# Altium project WEB_Server.PrjPcb
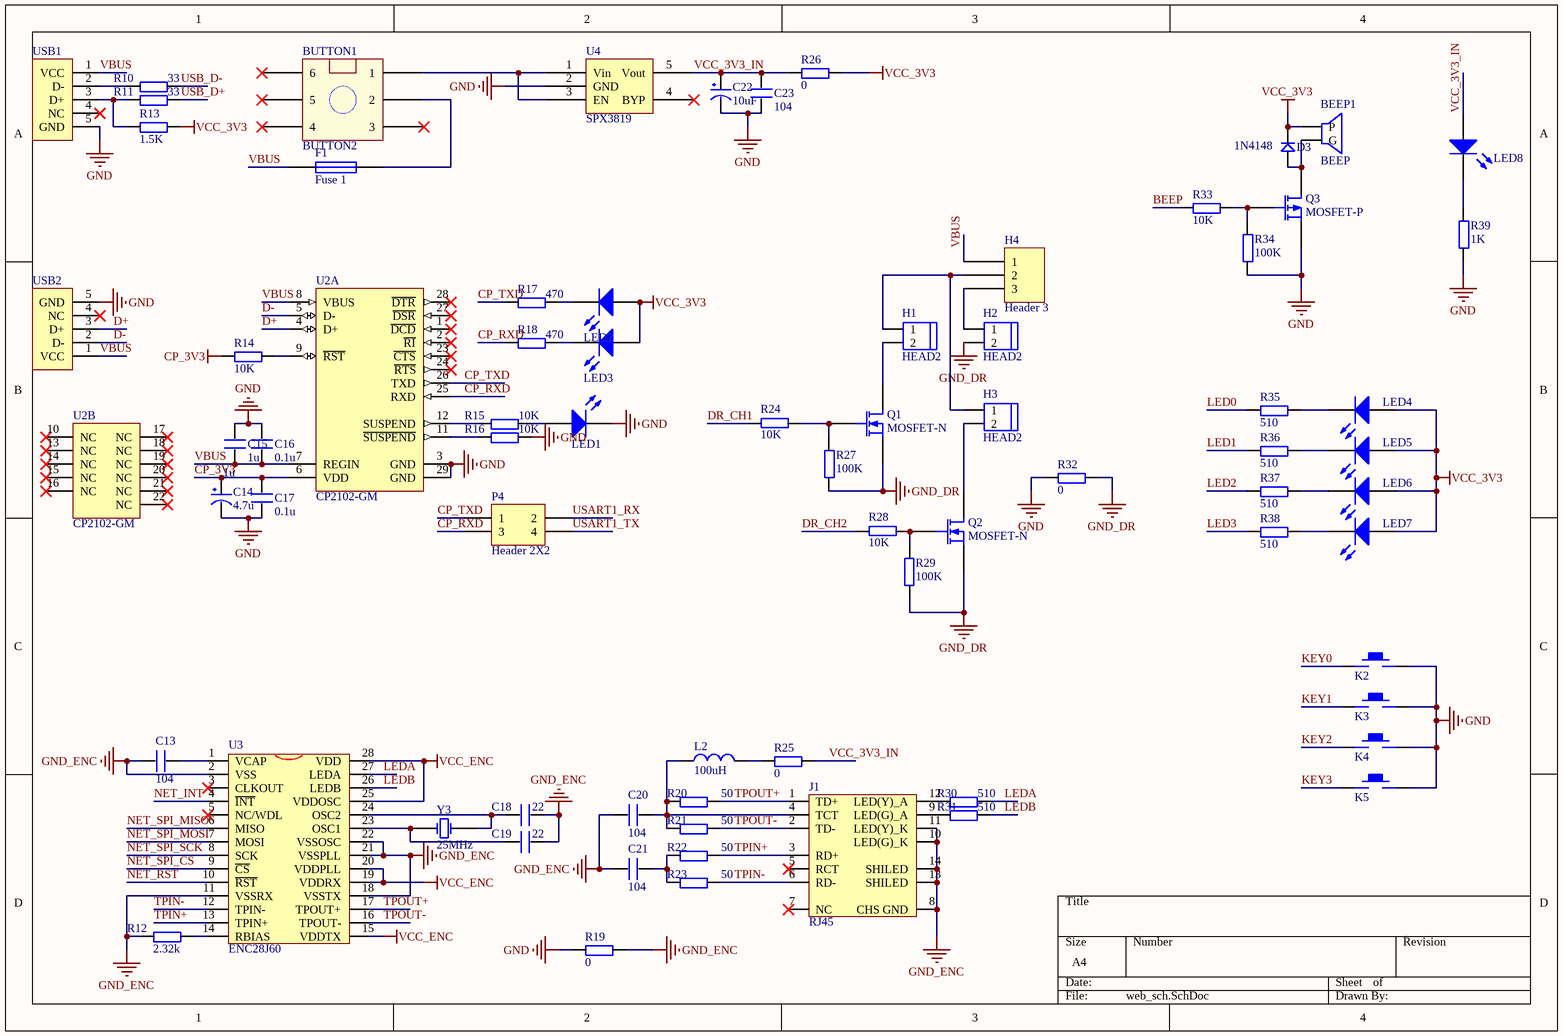
[diagram p0: web_sch.SchDoc]
2 sheets, 107 parts. Net scope: global (net labels, ports and power ports of the same name join across sheets).
Board file: WEB_PCB.PcbDoc
Sheets:
  web_sch.SchDoc
  mcu_sys_sch.SchDoc

## Sheet web_sch.SchDoc
size A4

### Parts
BEEP1  BEEP  [BELL-5]
BUTTON1  BUTTON2  [BTN8.5*8.5]
C13  104  [0603P]
C14  4.7u  [TAJ_A]
C15  1u  [0603P]
C16  0.1u  [0603P]
C17  0.1u  [0603P]
C18  22  [0603P]
C19  22  [0603P]
C20  104  [0603P]
C21  104  [0603P]
C22  10uF  [TAJ_A]
C23  104  [0603P]
D3  1N4148  [DIODE_SOP]
F1  Fuse 1  [0603P]
H1  HEAD2  [HEAD2L-0.8]
H2  HEAD2  [HEAD2L-0.8]
H3  HEAD2  [HEAD2L-0.8]
H4  Header 3  [HEAD3]
J1  RJ45  [RJ8-1]
K2  KEY  [KEY2]  (value not drawn)
K3  KEY  [KEY2]  (value not drawn)
K4  KEY  [KEY2]  (value not drawn)
K5  KEY  [KEY2]  (value not drawn)
L2  100uH  [0603P]
LED1  LED  [LED_0603]  (value not drawn)
LED2  LED  [LED_0603]  (value not drawn)
LED3  LED  [LED_0603]  (value not drawn)
LED4  LED  [LED_0603]  (value not drawn)
LED5  LED  [LED_0603]  (value not drawn)
LED6  LED  [LED_0603]  (value not drawn)
LED7  LED  [LED_0603]  (value not drawn)
LED8  LED  [LED_0603]  (value not drawn)
P4  Header 2X2  [HDR2X2]
Q1  MOSFET-N  [SOT-23]
Q2  MOSFET-N  [SOT-23]
Q3  MOSFET-P  [SOT-23]
R10  33  [0603P]
R11  33  [0603P]
R12  2.32k  [0603P]
R13  1.5K  [0603P]
R14  10K  [0603P]
R15  10K  [0603P]
R16  10K  [0603P]
R17  470  [0603P]
R18  470  [0603P]
R19  0  [0603P]
R20  50  [0603P]
R21  50  [0603P]
R22  50  [0603P]
R23  50  [0603P]
R24  10K  [0603P]
R25  0  [0603P]
R26  0  [0603P]
R27  100K  [0603P]
R28  10K  [0603P]
R29  100K  [0603P]
R30  510  [0603P]
R31  510  [0603P]
R32  0  [0603P]
R33  10K  [0603P]
R34  100K  [0603P]
R35  510  [0603P]
R36  510  [0603P]
R37  510  [0603P]
R38  510  [0603P]
R39  1K  [0603P]
U2  CP2102-GM  [SLAB-QFN-28-3125x3125TP_N]  (parts A,B of 2)
U3  ENC28J60  [SSOP28]
U4  SPX3819  [SOT23-5]
USB1  (no value)  [USB-MICRO-5P-2]
USB2  (no value)  [USB-MICRO-5P-2]
Y3  25MHz  [XTAL_US]

### Nets
CP_3V3: C14.1(VCC) C17.2 R14.1 U2.6(VDD)
GND: C14.2(GND) C15.2 C16.2 C17.1 C22.2(GND) C23.1 K2.2 K3.2 K4.2 K5.2 LED1.2(K) Q3.2(S) R16.2 R19.1 R32.1 R34.1 R39.1 U2.3(GND) U2.29(GND) U4.2(GND) USB1.5(GND) USB2.5(GND)
GND_DR: H2.2 Q1.2(S) Q2.2(S) R27.1 R29.2 R32.2
GND_ENC: C13.1 C18.2 C19.2 C20.1 C21.1 J1.8(CHS_GND) J1.10(LED(G)_K) J1.11(LED(Y)_K) J1.13(SHILED) J1.14(SHILED) R12.1 R19.2 U3.2(VSS) U3.11(VSSRX) U3.18(VSSTX) U3.21(VSSPLL) U3.22(VSSOSC)
VCC_3V3: BEEP1.1(P) D3.2 LED2.1(A) LED3.1(A) LED4.1(A) LED5.1(A) LED6.1(A) LED7.1(A) R13.2 R26.2
VCC_ENC: U3.15(VDDTX) U3.19(VDDRX) U3.20(VDDPLL) U3.25(VDDOSC) U3.28(VDD)
BEEP: R33.1
CP_RXD: P4.3 R18.1 U2.25(RXD)
CP_TXD: P4.1 R17.1 U2.26(TXD)
D+: U2.4(D+) USB2.3(D+)
D-: U2.5(D-) USB2.2(D-)
DR_CH1: R24.2
DR_CH2: R28.2
KEY0: K2.1
KEY1: K3.1
KEY2: K4.1
KEY3: K5.1
LED0: R35.1
LED1: R36.1
LED2: R37.1
LED3: R38.1
LEDA: R30.2 U3.27(LEDA)
LEDB: R31.2 U3.26(LEDB)
NET_INT: U3.4(~{INT})
NET_RST: U3.10(~{RST})
NET_SPI_CS: U3.9(~{CS})
NET_SPI_MISO: U3.6(MISO)
NET_SPI_MOSI: U3.7(MOSI)
NET_SPI_SCK: U3.8(SCK)
TPIN+: J1.3(RD+) R22.2 U3.13(TPIN+)
TPIN-: J1.6(RD-) R23.2 U3.12(TPIN-)
TPOUT+: J1.1(TD+) R20.2 U3.17(TPOUT+)
TPOUT-: J1.2(TD-) R21.2 U3.16(TPOUT-)
USART1_RX: P4.2  [project net PA10]
USART1_TX: P4.4  [project net PA9]
USB_D+: R11.2  [project net PA12]
USB_D-: R10.2  [project net PA11]
VBUS: C15.1 C16.1 F1.1 H4.1 U2.7(REGIN) U2.8(VBUS) USB1.1(VCC) USB2.1(VCC)
VCC_3V3_IN: C22.1(VCC) C23.2 LED8.1(A) R25.2 R26.1 U4.5(Vout)
NetBEEP1_2: BEEP1.2(G) D3.1 Q3.3(D)
NetBUTTON1_1: BUTTON1.1 U4.1(Vin) U4.3(EN)
NetBUTTON1_2: BUTTON1.2 F1.2
NetC13_2: C13.2 U3.1(VCAP)
NetC18_1: C18.1 U3.24(OSC2) Y3.2(OSC2)
NetC19_1: C19.1 U3.23(OSC1) Y3.1(OSC1)
NetC20_2: C20.2 J1.4(TCT) L2.1 R20.1 R21.1
NetC21_2: C21.2 R22.1 R23.1
NetH1_1: H1.1 H3.1 H4.2
NetH1_2: H1.2 Q1.3(D)
NetH2_1: H2.1 H4.3
NetH3_2: H3.2 Q2.3(D)
NetJ1_9: J1.9(LED(G)_A) R31.1
NetJ1_12: J1.12(LED(Y)_A) R30.1
NetL2_2: L2.2 R25.1
NetLED1_1: LED1.1(A) R15.2
NetLED2_2: LED2.2(K) R17.2
NetLED3_2: LED3.2(K) R18.2
NetLED4_2: LED4.2(K) R35.2
NetLED5_2: LED5.2(K) R36.2
NetLED6_2: LED6.2(K) R37.2
NetLED7_2: LED7.2(K) R38.2
NetLED8_2: LED8.2(K) R39.2
NetQ1_1: Q1.1(G) R24.1 R27.2
NetQ2_1: Q2.1(G) R28.1 R29.1
NetQ3_1: Q3.1(G) R33.2 R34.2
NetR10_1: R10.1 USB1.2(D-)
NetR11_1: R11.1 R13.1 USB1.3(D+)
NetR12_2: R12.2 U3.14(RBIAS)
NetR14_2: R14.2 U2.9(~{RST})
NetR15_1: R15.1 U2.12(SUSPEND)
NetR16_1: R16.1 U2.11(~{SUSPEND})

Not connected (* = marked no-connect by the designer): BUTTON1 3* 4* 5* 6*; J1 5(RCT)* 7(NC)*; U2 1(~{DCD})* 2(~{RI})* 10(NC)* 13(NC)* 14(NC)* 15(NC)* 16(NC)* 17(NC)* 18(NC)* 19(NC)* 20(NC)* 21(NC)* 22(NC)* 23(~{CTS})* 24(~{RTS})* 27(~{DSR})* 28(~{DTR})*; U3 3(CLKOUT)* 5(NC/WDL)*; U4 4(BYP)*; USB1 4(NC)*; USB2 4(NC)*

### Library data of the parts
C13 C15-C21 C23 = C
C14 C22 = CAP
D3 = D
F1 = Fuse 1: Fuse; Published: 8-Jun-2000; LatestRevisionDate: 17-Jul-2002; LatestRevisionNote: Re-released for DXP Platform.; PackageReference: PIN-W2/E2.8; Publisher: Altium Limited; PackageDescription: Thru-Hole; 2 Leads
J1 = HR911105
L2 = Inductor: Value: 100uH
LED1-LED8 = LED: Typical RED, GREEN, YELLOW, AMBER GaAs LED; Published: 8-Jun-2000; LatestRevisionDate: 17-Jul-2002; LatestRevisionNote: Re-released for DXP Platform.; PackageDocument: Feb-2002; PackageReference: 3.2X1.6X1.1; Publisher: Altium Limited
P4 = Header 2X2: Header, 2-Pin, Dual row; LatestRevisionDate: 17-Jul-2002; LatestRevisionNote: Re-released for DXP Platform.; Publisher: Altium Limited
Q1 Q2 = MOSFET-N: N-Channel MOSFET; Published: 8-Jun-2000; LatestRevisionDate: 17-Jul-2002; LatestRevisionNote: Re-released for DXP Platform.; PackageVersion: 1995/1996; PackageReference: E3; Publisher: Altium Limited; PackageDescription: TO, Flat Index; 3 In-Line, Axial Leads; Body Dia. 4.6mm; Lead Dia. 0.5 mm (max)
Q3 = MOSFET-P: P-Channel MOSFET; Published: 8-Jun-2000; LatestRevisionDate: 17-Jul-2002; LatestRevisionNote: Re-released for DXP Platform.; PackageVersion: 1995/1996; PackageReference: E3; Publisher: Altium Limited; PackageDescription: TO, Flat Index; 3 In-Line, Axial Leads; Body Dia. 4.6mm; Lead Dia. 0.5 mm (max)
R10-R39 = R
U2 = CP2102-GM: Single-Chip USB to UART Bridge, 1024 Bytes EEPROM, -40 to 85 degC, 28-pin QFN, Tube; Manufacturer: Silicon Labs; Internal Oscillator: TRUE; Sub-Family: USB Bridges; DatasheetVersion: Rev. 1.5; PackageReference: QFN-28; PackageDescription: 28-Pin Quad-Flat No-Leads Package, Body 5 x 5 mm, Pitch 0.5 mm; Supplier 1: Digi-Key; Supplier Part Number 1: 336-1160-5-ND; Supplier 2: Farnell; Supplier Part Number 2: 9282130; Supplier 3: Newark; Supplier Part Number 3: 30K5635; Supplier 4: Mouser; Supplier Part Number 4: 634-CP2102-GM; EEPROM: 1024 Bytes; Mounting Technology: Surface Mount; Code_JEDEC: MO-220; Code_IPC: J-STD-020C; PartNumber: CP2102-GM; ComponentLink1Description: Manufacturer URL; ComponentLink1URL: http://www.silabs.com/; ComponentLink2Description: Datasheet; ComponentLink2URL: http://www.silabs.com/Support%20Documents/TechnicalDocs/CP2102-9.pdf; ComponentLink3Description: Package Specification; ComponentLink3URL: http://www.silabs.com/Support%20Documents/TechnicalDocs/C8051T61x.pdf
USB1 USB2 = USB5
Y3 = XTAL: Crystal Oscillator; Published: 8-Jun-2000; LatestRevisionDate: 17-Jul-2002; LatestRevisionNote: Re-released for DXP Platform.; Publisher: Altium Limited

## Sheet mcu_sys_sch.SchDoc
size A4
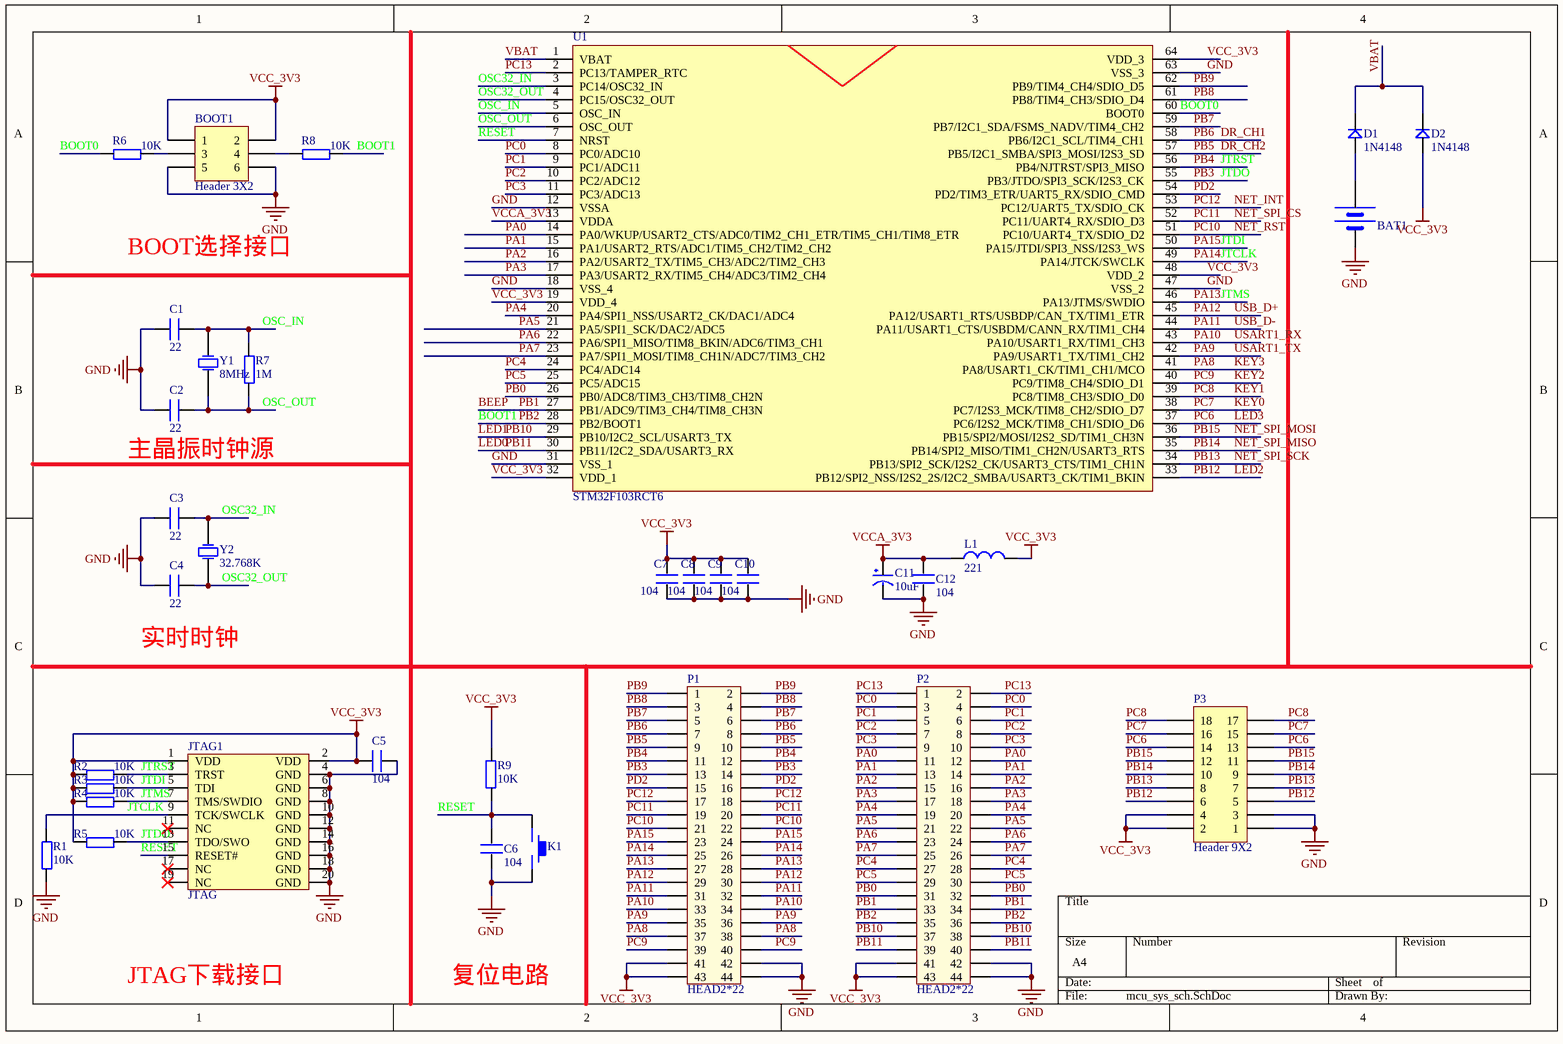
[diagram p1: mcu_sys_sch.SchDoc]

### Parts
BAT1  BATT  [BATM]  (value not drawn)
BOOT1  Header 3X2  [HDR2X3]
C1  22  [0603P]
C2  22  [0603P]
C3  22  [0603P]
C4  22  [0603P]
C5  104  [0603P]
C6  104  [0603P]
C7  104  [0603P]
C8  104  [0603P]
C9  104  [0603P]
C10  104  [0603P]
C11  10uF  [TAJ_A]
C12  104  [0603P]
D1  1N4148  [DIODE_SOP]
D2  1N4148  [DIODE_SOP]
JTAG1  JTAG  [JTAG_20]
K1  KEY  [KEY2]  (value not drawn)
L1  221  [0603P]
P1  HEAD2*22  [HEAD2*22]
P2  HEAD2*22  [HEAD2*22]
P3  Header 9X2  [HDR2X9]
R1  10K  [0603P]
R2  10K  [0603P]
R3  10K  [0603P]
R4  10K  [0603P]
R5  10K  [0603P]
R6  10K  [0603P]
R7  1M  [0603P]
R8  10K  [0603P]
R9  10K  [0603P]
U1  STM32F103RCT6  [STM-LQFP64_N]
Y1  8MHz  [X-SM49]
Y2  32.768K  [XTAL32]

### Nets
GND: BAT1.2(GND) BOOT1.5 BOOT1.6 C1.1 C2.1 C3.1 C4.1 C5.2 C6.1 C7.1 C8.1 C9.1 C10.1 C11.2(GND) C12.1 JTAG1.4(GND) JTAG1.6(GND) JTAG1.8(GND) JTAG1.10(GND) JTAG1.12(GND) JTAG1.14(GND) JTAG1.16(GND) JTAG1.18(GND) JTAG1.20(GND) K1.1 P1.42 P1.44 P2.42 P2.44 P3.1 P3.3 R1.1 U1.12(VSSA) U1.18(VSS_4) U1.31(VSS_1) U1.47(VSS_2) U1.63(VSS_3)
VCC_3V3: BOOT1.1 BOOT1.2 C5.1 C7.2 C8.2 C9.2 C10.2 D2.1 JTAG1.1(VDD) JTAG1.2(VDD) L1.2 P1.41 P1.43 P2.41 P2.43 P3.2 P3.4 R2.1 R3.1 R4.1 R5.1 R9.2 U1.19(VDD_4) U1.32(VDD_1) U1.48(VDD_2) U1.64(VDD_3)
VCCA_3V3: C11.1(VCC) C12.2 L1.1 U1.13(VDDA)
BEEP: P2.33 P2.34 U1.27(PB1/ADC9/TIM3_CH4/TIM8_CH3N)  [also labelled PB1]
BOOT0: R6.1 U1.60(BOOT0)
BOOT1: P2.35 P2.36 R8.2 U1.28(PB2/BOOT1)  [also labelled PB2]
DR_CH1: P1.7 P1.8 U1.58(PB6/I2C1_SCL/TIM4_CH1)  [also labelled PB6]
DR_CH2: P1.9 P1.10 U1.57(PB5/I2C1_SMBA/SPI3_MOSI/I2S3_SD)  [also labelled PB5]
JTCLK: JTAG1.9(TCK/SWCLK) P1.25 P1.26 R1.2 U1.49(PA14/JTCK/SWCLK)  [also labelled PA14]
JTDI: JTAG1.5(TDI) P1.23 P1.24 R3.2 U1.50(PA15/JTDI/SPI3_NSS/I2S3_WS)  [also labelled PA15]
JTDO: JTAG1.13(TDO/SWO) P1.13 P1.14 R5.2 U1.55(PB3/JTDO/SPI3_SCK/I2S3_CK)  [also labelled PB3]
JTMS: JTAG1.7(TMS/SWDIO) P1.27 P1.28 R4.2 U1.46(PA13/JTMS/SWDIO)  [also labelled PA13]
JTRST: JTAG1.3(TRST) P1.11 P1.12 R2.2 U1.56(PB4/NJTRST/SPI3_MISO)  [also labelled PB4]
KEY0: P3.15 P3.16 U1.38(PC7/I2S3_MCK/TIM8_CH2/SDIO_D7)  [also labelled PC7]
KEY1: P3.17 P3.18 U1.39(PC8/TIM8_CH3/SDIO_D0)  [also labelled PC8]
KEY2: P1.39 P1.40 U1.40(PC9/TIM8_CH4/SDIO_D1)  [also labelled PC9]
KEY3: P1.37 P1.38 U1.41(PA8/USART1_CK/TIM1_CH1/MCO)  [also labelled PA8]
LED0: P2.39 P2.40 U1.30(PB11/I2C2_SDA/USART3_RX)  [also labelled PB11]
LED1: P2.37 P2.38 U1.29(PB10/I2C2_SCL/USART3_TX)  [also labelled PB10]
LED2: P3.5 P3.6 U1.33(PB12/SPI2_NSS/I2S2_2S/I2C2_SMBA/USART3_CK/TIM1_BKIN)  [also labelled PB12]
LED3: P3.13 P3.14 U1.37(PC6/I2S2_MCK/TIM8_CH1/SDIO_D6)  [also labelled PC6]
NET_INT: P1.17 P1.18 U1.53(PC12/UART5_TX/SDIO_CK)  [also labelled PC12]
NET_RST: P1.21 P1.22 U1.51(PC10/UART4_TX/SDIO_D2)  [also labelled PC10]
NET_SPI_CS: P1.19 P1.20 U1.52(PC11/UART4_RX/SDIO_D3)  [also labelled PC11]
NET_SPI_MISO: P3.9 P3.10 U1.35(PB14/SPI2_MISO/TIM1_CH2N/USART3_RTS)  [also labelled PB14]
NET_SPI_MOSI: P3.11 P3.12 U1.36(PB15/SPI2/MOSI/I2S2_SD/TIM1_CH3N)  [also labelled PB15]
NET_SPI_SCK: P3.7 P3.8 U1.34(PB13/SPI2_SCK/I2S2_CK/USART3_CTS/TIM1_CH1N)  [also labelled PB13]
OSC32_IN: C3.2 U1.3(PC14/OSC32_IN) Y2.2(OSC2)
OSC32_OUT: C4.2 U1.4(PC15/OSC32_OUT) Y2.1(OSC1)
OSC_IN: C1.2 R7.2 U1.5(OSC_IN) Y1.2(OSC2)
OSC_OUT: C2.2 R7.1 U1.6(OSC_OUT) Y1.1(OSC1)
PA0: P2.11 P2.12 U1.14(PA0/WKUP/USART2_CTS/ADC0/TIM2_CH1_ETR/TIM5_CH1/TIM8_ETR)
PA1: P2.13 P2.14 U1.15(PA1/USART2_RTS/ADC1/TIM5_CH2/TIM2_CH2)
PA2: P2.15 P2.16 U1.16(PA2/USART2_TX/TIM5_CH3/ADC2/TIM2_CH3)
PA3: P2.17 P2.18 U1.17(PA3/USART2_RX/TIM5_CH4/ADC3/TIM2_CH4)
PA4: P2.19 P2.20 U1.20(PA4/SPI1_NSS/USART2_CK/DAC1/ADC4)
PA5: P2.21 P2.22 U1.21(PA5/SPI1_SCK/DAC2/ADC5)
PA6: P2.23 P2.24 U1.22(PA6/SPI1_MISO/TIM8_BKIN/ADC6/TIM3_CH1)
PA7: P2.25 P2.26 U1.23(PA7/SPI1_MOSI/TIM8_CH1N/ADC7/TIM3_CH2)
PA9: P1.35 P1.36 U1.42(PA9/USART1_TX/TIM1_CH2)  [also labelled USART1_TX]
PA10: P1.33 P1.34 U1.43(PA10/USART1_RX/TIM1_CH3)  [also labelled USART1_RX]
PA11: P1.31 P1.32 U1.44(PA11/USART1_CTS/USBDM/CANN_RX/TIM1_CH4)  [also labelled USB_D-]
PA12: P1.29 P1.30 U1.45(PA12/USART1_RTS/USBDP/CAN_TX/TIM1_ETR)  [also labelled USB_D+]
PB0: P2.31 P2.32 U1.26(PB0/ADC8/TIM3_CH3/TIM8_CH2N)
PB7: P1.5 P1.6 U1.59(PB7/I2C1_SDA/FSMS_NADV/TIM4_CH2)
PB8: P1.3 P1.4 U1.61(PB8/TIM4_CH3/SDIO_D4)
PB9: P1.1 P1.2 U1.62(PB9/TIM4_CH4/SDIO_D5)
PC0: P2.3 P2.4 U1.8(PC0/ADC10)
PC1: P2.5 P2.6 U1.9(PC1/ADC11)
PC2: P2.7 P2.8 U1.10(PC2/ADC12)
PC3: P2.9 P2.10 U1.11(PC3/ADC13)
PC4: P2.27 P2.28 U1.24(PC4/ADC14)
PC5: P2.29 P2.30 U1.25(PC5/ADC15)
PC13: P2.1 P2.2 U1.2(PC13/TAMPER_RTC)
PD2: P1.15 P1.16 U1.54(PD2/TIM3_ETR/UART5_RX/SDIO_CMD)
RESET: C6.2 JTAG1.15(RESET#) K1.2 R9.1 U1.7(NRST)
VBAT: D1.2 D2.2 U1.1(VBAT)
NetBAT1_1: BAT1.1(VCC) D1.1
NetBOOT1_3: BOOT1.3 R6.2
NetBOOT1_4: BOOT1.4 R8.1

Not connected (* = marked no-connect by the designer): JTAG1 11(NC)* 17(NC)* 19(NC)*

### Notes on the sheet
- BOOT选择接口
- (near C2) 主晶振时钟源
- (near C4) 实时时钟
- JTAG下载接口
- 复位电路

### Library data of the parts
BAT1 = BAT
BOOT1 = Header 3X2: Header, 3-Pin, Dual row; LatestRevisionDate: 17-Jul-2002; LatestRevisionNote: Re-released for DXP Platform.; Publisher: Altium Limited
C1-C10 C12 = C
C11 = CAP
D1 D2 = D
L1 = Inductor: Value: 221
P3 = Header 9X2: Header, 9-Pin, Dual row; LatestRevisionDate: 17-Jul-2002; LatestRevisionNote: Re-released for DXP Platform.; Publisher: Altium Limited
R1-R9 = R
Y1 Y2 = XTAL: Crystal Oscillator; Published: 8-Jun-2000; LatestRevisionDate: 17-Jul-2002; LatestRevisionNote: Re-released for DXP Platform.; Publisher: Altium Limited

## Nets that join several sheets
GND: web_sch (22 pins), mcu_sys_sch (37 pins)
VCC_3V3: web_sch (10 pins), mcu_sys_sch (26 pins)
BEEP: web_sch (R33.1), mcu_sys_sch (P2.33 P2.34 U1.27)
DR_CH1: web_sch (R24.2), mcu_sys_sch (P1.7 P1.8 U1.58)
DR_CH2: web_sch (R28.2), mcu_sys_sch (P1.9 P1.10 U1.57)
KEY0: web_sch (K2.1), mcu_sys_sch (P3.15 P3.16 U1.38)
KEY1: web_sch (K3.1), mcu_sys_sch (P3.17 P3.18 U1.39)
KEY2: web_sch (K4.1), mcu_sys_sch (P1.39 P1.40 U1.40)
KEY3: web_sch (K5.1), mcu_sys_sch (P1.37 P1.38 U1.41)
LED0: web_sch (R35.1), mcu_sys_sch (P2.39 P2.40 U1.30)
LED1: web_sch (R36.1), mcu_sys_sch (P2.37 P2.38 U1.29)
LED2: web_sch (R37.1), mcu_sys_sch (P3.5 P3.6 U1.33)
LED3: web_sch (R38.1), mcu_sys_sch (P3.13 P3.14 U1.37)
NET_INT: web_sch (U3.4), mcu_sys_sch (P1.17 P1.18 U1.53)
NET_RST: web_sch (U3.10), mcu_sys_sch (P1.21 P1.22 U1.51)
NET_SPI_CS: web_sch (U3.9), mcu_sys_sch (P1.19 P1.20 U1.52)
NET_SPI_MISO: web_sch (U3.6), mcu_sys_sch (P3.9 P3.10 U1.35)
NET_SPI_MOSI: web_sch (U3.7), mcu_sys_sch (P3.11 P3.12 U1.36)
NET_SPI_SCK: web_sch (U3.8), mcu_sys_sch (P3.7 P3.8 U1.34)
PA9: web_sch (P4.4), mcu_sys_sch (P1.35 P1.36 U1.42)
PA10: web_sch (P4.2), mcu_sys_sch (P1.33 P1.34 U1.43)
PA11: web_sch (R10.2), mcu_sys_sch (P1.31 P1.32 U1.44)
PA12: web_sch (R11.2), mcu_sys_sch (P1.29 P1.30 U1.45)